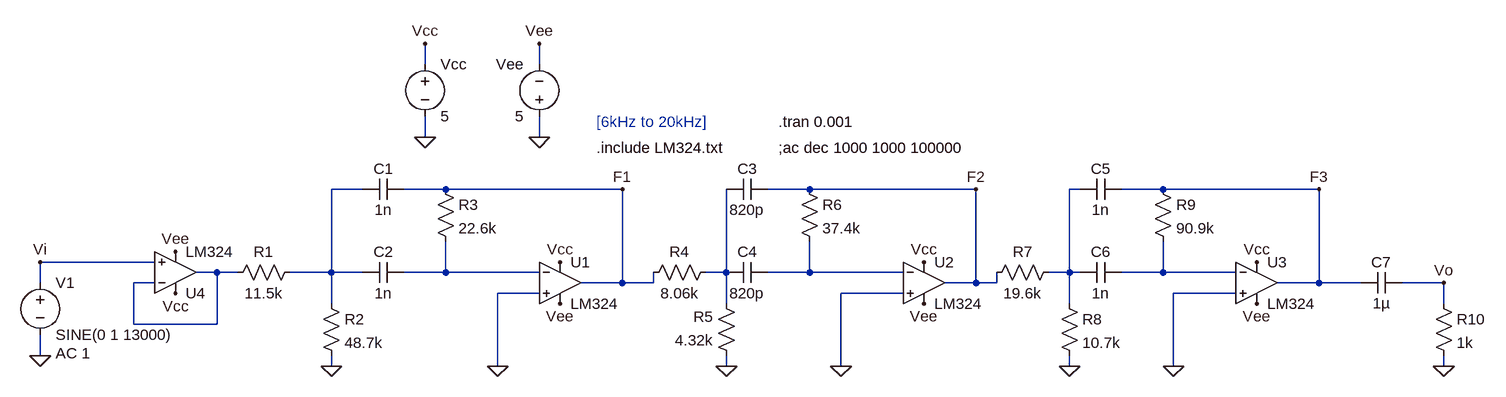
[diagram p0: schematic FinalBrillianceFilterBUF.asc]
FinalBrillianceFilterBUF.asc, the LTspice schematic file:
Version 4
SHEET 1 1524 680
WIRE -112 -176 -112 -208
WIRE 64 -176 64 -208
WIRE -112 -64 -112 -96
WIRE 64 -64 64 -96
WIRE -208 16 -256 16
WIRE -80 16 -144 16
WIRE 192 16 -80 16
WIRE 480 16 416 16
WIRE 736 16 480 16
WIRE 896 16 880 16
WIRE 1024 16 960 16
WIRE 1264 16 1024 16
WIRE -528 128 -704 128
WIRE -432 144 -464 144
WIRE -400 144 -432 144
WIRE -256 144 -256 16
WIRE -256 144 -320 144
WIRE -208 144 -256 144
WIRE -80 144 -80 96
WIRE -80 144 -144 144
WIRE 64 144 -80 144
WIRE 352 144 352 16
WIRE 352 144 320 144
WIRE 480 144 480 96
WIRE 480 144 416 144
WIRE 624 144 480 144
WIRE 880 144 880 16
WIRE 880 144 848 144
WIRE 896 144 880 144
WIRE 1024 144 1024 96
WIRE 1024 144 960 144
WIRE 1136 144 1024 144
WIRE -704 160 -704 128
WIRE -528 160 -560 160
WIRE 192 160 192 16
WIRE 192 160 128 160
WIRE 240 160 240 144
WIRE 240 160 192 160
WIRE 736 160 736 16
WIRE 736 160 688 160
WIRE 768 160 768 144
WIRE 768 160 736 160
WIRE 1264 160 1264 16
WIRE 1264 160 1200 160
WIRE 1328 160 1264 160
WIRE 1456 160 1392 160
WIRE 64 176 0 176
WIRE 624 176 528 176
WIRE 1136 176 1040 176
WIRE -256 192 -256 144
WIRE 352 192 352 144
WIRE 880 192 880 144
WIRE 1456 192 1456 160
WIRE -560 224 -560 160
WIRE -432 224 -432 144
WIRE -432 224 -560 224
WIRE -704 272 -704 240
WIRE -256 288 -256 272
WIRE 0 288 0 176
WIRE 352 288 352 272
WIRE 528 288 528 176
WIRE 880 288 880 272
WIRE 1040 288 1040 176
WIRE 1456 288 1456 272
FLAG 528 288 0
FLAG -704 272 0
FLAG 192 16 F1
FLAG 736 16 F2
FLAG -704 128 Vi
FLAG 1040 288 0
FLAG 1264 16 F3
FLAG 880 288 0
FLAG 352 288 0
FLAG -256 288 0
FLAG 0 288 0
FLAG -112 -208 Vcc
FLAG -112 -64 0
FLAG 64 -64 0
FLAG 64 -208 Vee
FLAG 96 192 Vee
FLAG 96 128 Vcc
FLAG 656 192 Vee
FLAG 656 128 Vcc
FLAG 1168 192 Vee
FLAG 1168 128 Vcc
FLAG 1456 288 0
FLAG 1456 160 Vo
FLAG -496 112 Vee
FLAG -496 176 Vcc
SYMBOL res -304 128 R90
WINDOW 0 0 56 VBottom 2
WINDOW 3 32 56 VTop 2
SYMATTR InstName R1
SYMATTR Value 11.5k
SYMBOL voltage -704 144 R0
WINDOW 123 24 124 Left 2
WINDOW 39 0 0 Left 0
SYMATTR Value2 AC 1
SYMATTR InstName V1
SYMATTR Value SINE(0 1 13000)
SYMBOL res -96 0 R0
SYMATTR InstName R3
SYMATTR Value 22.6k
SYMBOL res 336 128 R90
WINDOW 0 0 56 VBottom 2
WINDOW 3 32 56 VTop 2
SYMATTR InstName R4
SYMATTR Value 8.06k
SYMBOL res 368 288 R180
WINDOW 0 36 76 Left 2
WINDOW 3 36 40 Left 2
SYMATTR InstName R5
SYMATTR Value 4.32k
SYMBOL res 464 0 R0
SYMATTR InstName R6
SYMATTR Value 37.4k
SYMBOL res 752 160 R270
WINDOW 0 32 56 VTop 2
WINDOW 3 0 56 VBottom 2
SYMATTR InstName R7
SYMATTR Value 19.6k
SYMBOL res 864 176 R0
SYMATTR InstName R8
SYMATTR Value 10.7k
SYMBOL res 1008 0 R0
SYMATTR InstName R9
SYMATTR Value 90.9k
SYMBOL cap -144 0 R90
WINDOW 0 0 32 VBottom 2
WINDOW 3 32 32 VTop 2
SYMATTR InstName C1
SYMATTR Value 1n
SYMBOL cap -144 128 R90
WINDOW 0 0 32 VBottom 2
WINDOW 3 32 32 VTop 2
SYMATTR InstName C2
SYMATTR Value 1n
SYMBOL cap 416 0 R90
WINDOW 0 0 32 VBottom 2
WINDOW 3 32 32 VTop 2
SYMATTR InstName C3
SYMATTR Value 820p
SYMBOL cap 416 128 R90
WINDOW 0 0 32 VBottom 2
WINDOW 3 32 32 VTop 2
SYMATTR InstName C4
SYMATTR Value 820p
SYMBOL cap 960 0 R90
WINDOW 0 0 32 VBottom 2
WINDOW 3 32 32 VTop 2
SYMATTR InstName C5
SYMATTR Value 1n
SYMBOL cap 960 128 R90
WINDOW 0 0 32 VBottom 2
WINDOW 3 32 32 VTop 2
SYMATTR InstName C6
SYMATTR Value 1n
SYMBOL res -272 176 R0
SYMATTR InstName R2
SYMATTR Value 48.7k
SYMBOL voltage -112 -192 R0
WINDOW 123 0 0 Left 0
WINDOW 39 0 0 Left 0
SYMATTR InstName Vcc
SYMATTR Value 5
SYMBOL voltage 64 -80 R180
WINDOW 0 24 96 Left 2
WINDOW 3 24 16 Left 2
WINDOW 123 0 0 Left 0
WINDOW 39 0 0 Left 0
SYMATTR InstName Vee
SYMATTR Value 5
SYMBOL OpAmps\\opamp2 96 96 R0
SYMATTR InstName U1
SYMATTR Value LM324
SYMBOL OpAmps\\opamp2 656 96 R0
SYMATTR InstName U2
SYMATTR Value LM324
SYMBOL OpAmps\\opamp2 1168 96 R0
SYMATTR InstName U3
SYMATTR Value LM324
SYMBOL cap 1392 144 R90
WINDOW 0 0 32 VBottom 2
WINDOW 3 32 32 VTop 2
SYMATTR InstName C7
SYMATTR Value 1µ
SYMBOL res 1440 176 R0
SYMATTR InstName R10
SYMATTR Value 1k
SYMBOL OpAmps\\opamp2 -496 208 M180
SYMATTR InstName U4
SYMATTR Value LM324
TEXT 432 -88 Left 2 !.tran 0.001
TEXT 432 -48 Left 2 !;ac dec 1000 1000 100000
TEXT 152 -88 Left 2 ;[6kHz to 20kHz]
TEXT 152 -48 Left 2 !.include LM324.txt

The netlist it stands for:
* FinalBrillianceFilterBUF.asc
R1 N001 N003 11.5k
V1 Vi 0 SINE(0 1 13000) AC 1
R3 F1 N004 22.6k
R4 N005 F1 8.06k
R5 0 N005 4.32k
R6 F2 N006 37.4k
R7 F2 N002 19.6k
R8 N002 0 10.7k
R9 F3 N007 90.9k
C1 F1 N001 1n
C2 N004 N001 1n
C3 F2 N005 820p
C4 N006 N005 820p
C5 F3 N002 1n
C6 N007 N002 1n
R2 N001 0 48.7k
Vcc Vcc 0 5
Vee 0 Vee 5
XU1 0 N004 Vcc Vee F1 LM324  ; pins In+ In- V+ V- OUT
XU2 0 N006 Vcc Vee F2 LM324  ; pins In+ In- V+ V- OUT
XU3 0 N007 Vcc Vee F3 LM324  ; pins In+ In- V+ V- OUT
C7 Vo F3 1µ
R10 Vo 0 1k
XU4 Vi N003 Vcc Vee N003 LM324  ; pins In+ In- V+ V- OUT
.tran 0.001
;ac dec 1000 1000 100000
* [6kHz to 20kHz]
.include LM324.txt
.backanno
.end